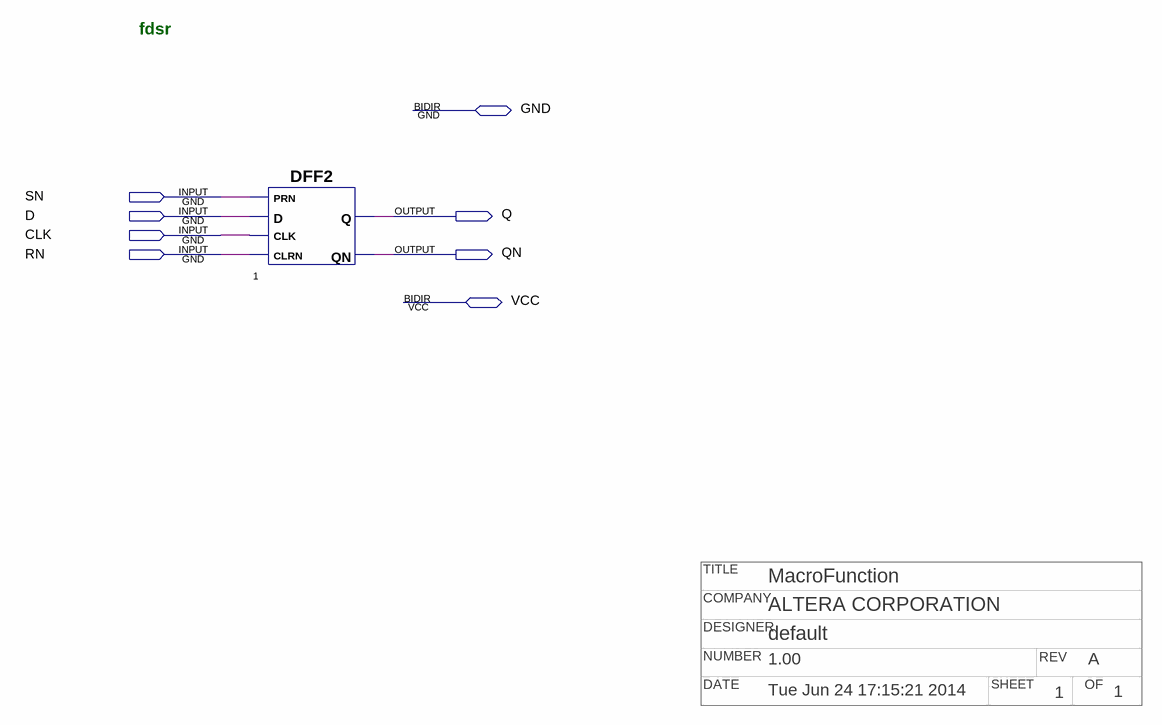
[diagram p0: schematic sheet]
// Quartus schematic npfdsr.bdf as structural Verilog: 1 symbols, 8 pins
// Title block: TITLE: MacroFunction; COMPANY: ALTERA CORPORATION; DESIGNER: default; NUMBER: 1.00; REV: A; DATE: Tue Jun 24 17:15:21 2014; SHEET: 1; OF: 1
module npfdsr (
  input  SN,
  input  D,
  input  CLK,
  input  RN,
  inout  GND,
  inout  VCC,
  output Q,
  output QN
);

  DFF2 u_1 (.CLK(CLK), .D(D), .PRN(SN), .CLRN(RN), .Q(Q), .QN(QN));

  // Notes on the sheet:
  //   fdsr
endmodule
